# EAGLE design Solar Charger Shield v2.2 (EAGLE 6.4)
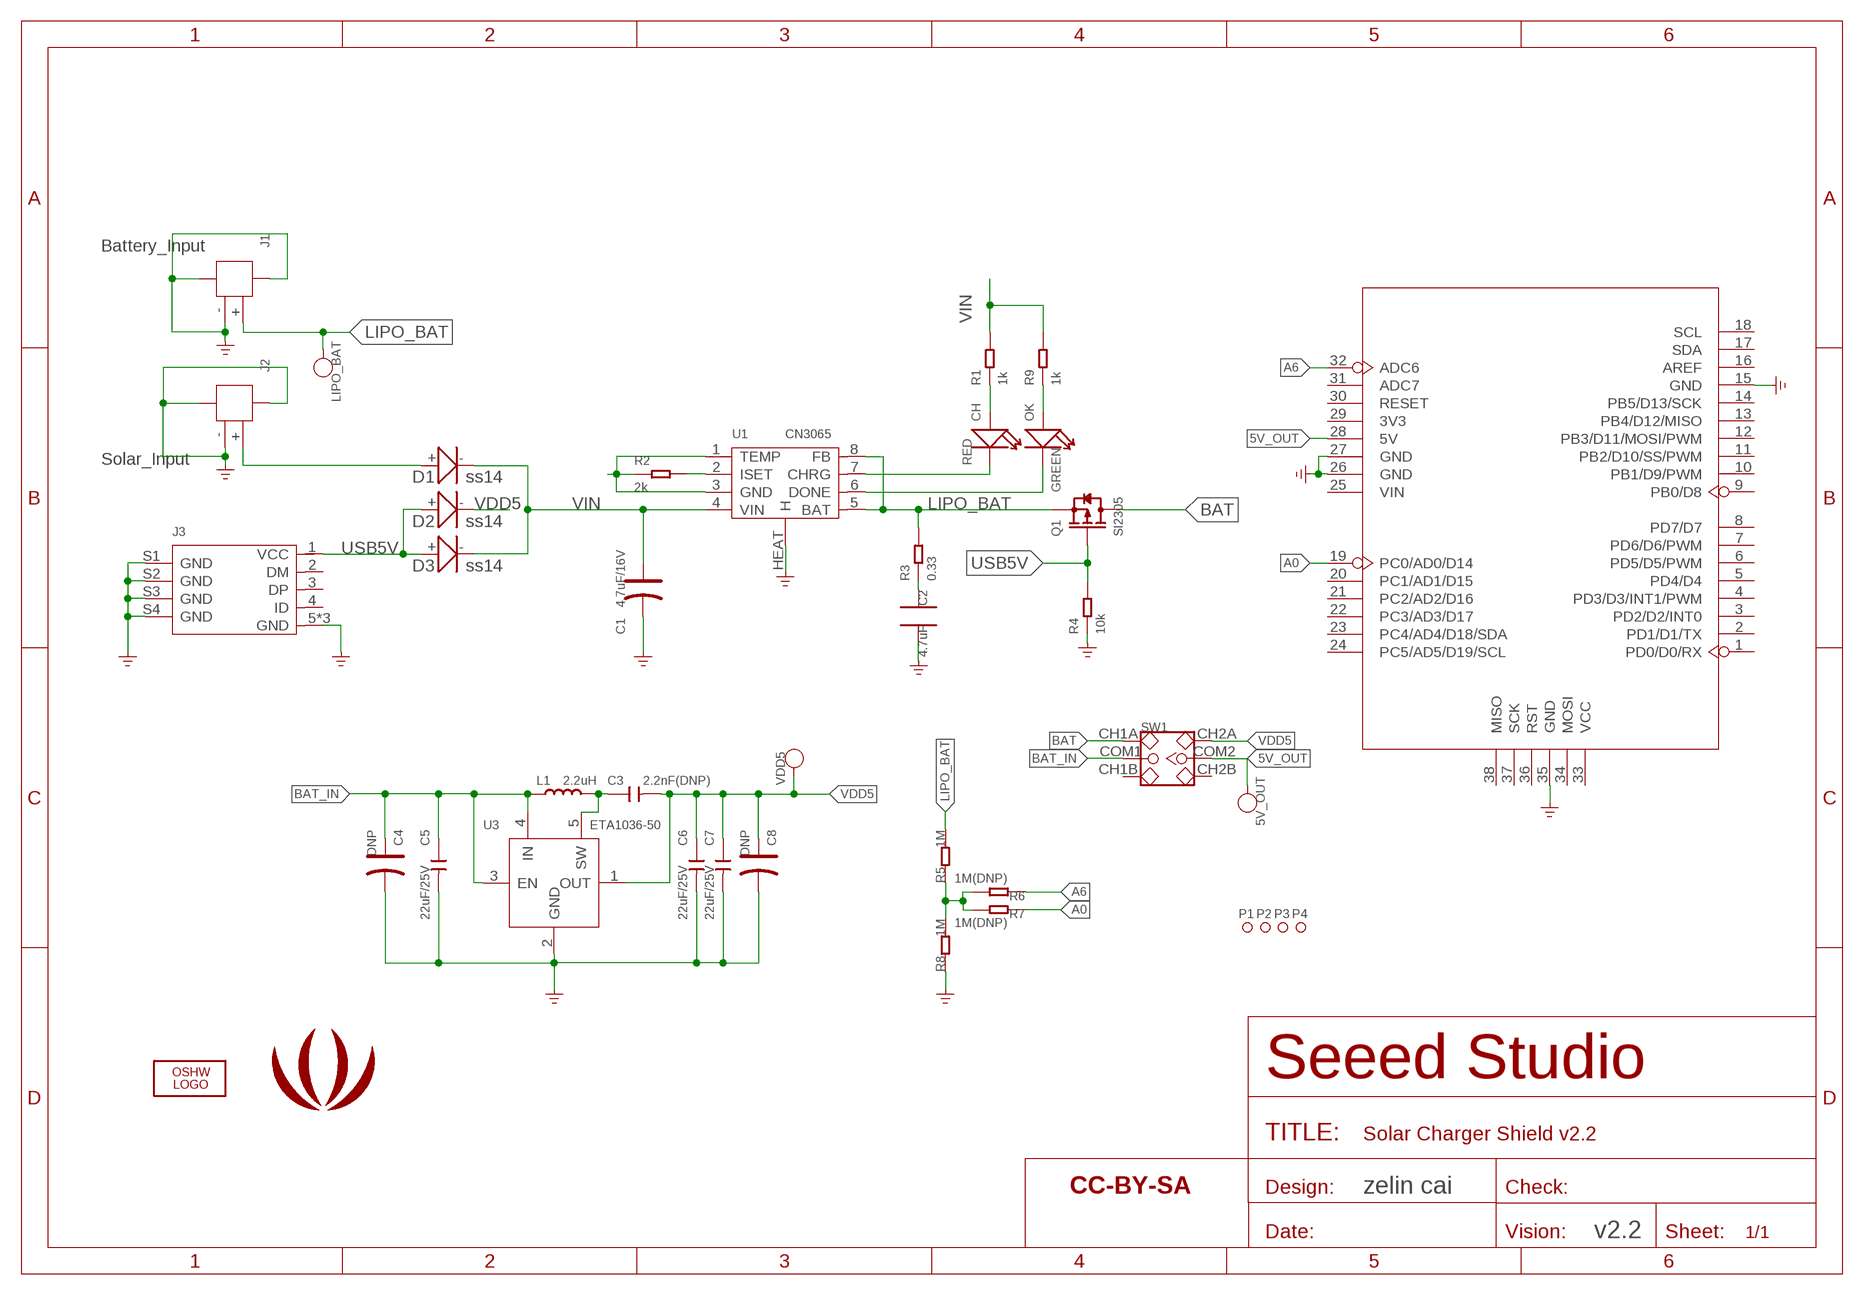
[diagram p0: schematic, sheet 1]

## Parts
5V_OUT  PAD-TEST-POINT'4545'  [TP-D45MIL]
C1  4.7uF/16V  006-CAP_AVX_A  [AVX_A]
C2  4.7uF  C0805  [0805]
C3  2.2nF(DNP)  C-0603  [C0603]
C4  DNP  CAP_AVX_A  [AVX-A]
C5  22uF/25V  CAP-0805  [C0805]
C6  22uF/25V  CAP-0805  [C0805]
C7  22uF/25V  CAP-0805  [C0805]
C8  DNP  CAP_AVX_A  [AVX-A]
CH  RED  LED'0603'  [LED-0603]
D1  ss14  010-D2010  [D2010]
D2  ss14  010-D2010  [D2010]
D3  ss14  010-D2010  [D2010]
J1  JST-2P-SMD'2.0'  [2P-SMD-2.0-90D]
J2  JST-2P-SMD'2.0'  [2P-SMD-2.0-90D]
J3  USB-MICRO-5P'5+4P'  [5+4P-SMD-0.65-B]
L1  2.2uH  INDUCTOR/FERRITE-BEAD'0630'  [L0630]
LIPO_BAT  PAD-TEST-POINT'4545'  [TP-D45MIL]
LOGO1  LOGO-OSHW-FILLX0200-NT  [OSHW_FILLX200_NOTEXT]
OK  GREEN  LED'0603'  [LED-0603]
P1  PAD-MARK'ANNULAR'  [ROUND-MARK-1.0]
P2  PAD-MARK'ANNULAR'  [ROUND-MARK-1.0]
P3  PAD-MARK'ANNULAR'  [ROUND-MARK-1.0]
P4  PAD-MARK'ANNULAR'  [ROUND-MARK-1.0]
Q1  SI2305  MOSFET-P'SI2323CDS/SI2305DS<BR>'  [SOT-23]
R1  1k  RES-0603  [R0603]
R2  2k  RES-0603  [R0603]
R3  0.33  RES-0603  [R0603]
R4  10k  RES-0603  [R0603]
R5  1M  R-0603  [0603]
R6  1M(DNP)  R-0603  [0603]
R7  1M(DNP)  R-0603  [0603]
R8  1M  R-0603  [0603]
R9  1k  RES-0603  [R0603]
SW1  SWITCH-2CH-6P'90D'  [6P-2CH-2.54-L9.0*W3.5*H3.2-90D]
U1  CN3065  PMIC-CN3065-DFN8  [DFN-8]
U2  ARDUINO-38P'WITH-SILK'  [ARDUINO-DIM-WITH-SILK]
U3  ETA1036-50  ETA1036  [SOT23-5]
U$1  LOGO-SEEEDSTUDIO-SILK  [LOGO_SILK]
U$2  SEEEDSTUDIO-OPEN-SCH-FRAME  [SEEEDSTUDIO-PCB-FRAME]
VDD5  PAD-TEST-POINT'4545'  [TP-D45MIL]

## Nets
5V_OUT: 5V_OUT.T SW1.COM2 U2.28(5V)
A0: R7.1 U2.19(PC0/AD0/D14)
A6: R6.1 U2.32(ADC6)
BAT: Q1.3(D) SW1.CH1A
BAT_IN: C4.+ C5.1 L1.1 SW1.COM1 U3.3(EN) U3.4(IN)
GND: C1.- C2.2 C4.- C5.2 C6.2 C7.2 C8.- J1.3 J1.4 J1.- J2.3 J2.4 J2.- J3.5(GND) J3.S1(GND) J3.S2(GND) J3.S3(GND) J3.S4(GND) J3.S5(GND) J3.S6(GND) R2.1 R4.1 R8.1 U1.1(TEMP) U1.3(GND) U1.HEAT(H) U2.15(GND) U2.26(GND) U2.27(GND) U2.35(GND) U3.2(GND) ; supply symbol labelled GND_POWER
LIPO_BAT: J1.+ LIPO_BAT.T Q1.2(S) R3.2 R5.2 U1.5(BAT) U1.8(FB)
N$1: R5.1 R6.2 R7.2 R8.2
N$2: C3.1 L1.2 U3.5(SW)
N$3: D1.+ J2.+
N$4: R2.2 U1.2(ISET)
N$5: CH.- U1.7(CHRG)
N$6: CH.+ R1.1
N$7: OK.- U1.6(DONE)
N$8: OK.+ R9.1
N$9: C2.1 R3.1
USB5V: D2.+ D3.+ J3.1(VCC) Q1.1(G) R4.2
VDD5: C3.2 C6.1 C7.1 C8.+ D2.- SW1.CH2A U3.1(OUT) VDD5.T
VIN: C1.+ D1.- D3.- R1.2 R9.2 U1.4(VIN)
Unconnected: J3.2(DM) J3.3(DP) J3.4(ID) SW1.CH1B SW1.CH2B U2.1(PD0/D0/RX) U2.2(PD1/D1/TX) U2.3(PD2/D2/INT0) U2.4(PD3/D3/INT1/PWM) U2.5(PD4/D4) U2.6(PD5/D5/PWM) U2.7(PD6/D6/PWM) U2.8(PD7/D7) U2.9(PB0/D8) U2.10(PB1/D9/PWM) U2.11(PB2/D10/SS/PWM) U2.12(PB3/D11/MOSI/PWM) U2.13(PB4/D12/MISO) U2.14(PB5/D13/SCK) U2.16(AREF) U2.17(SDA) U2.18(SCL) U2.20(PC1/AD1/D15) U2.21(PC2/AD2/D16) U2.22(PC3/AD3/D17) U2.23(PC4/AD4/D18/SDA) U2.24(PC5/AD5/D19/SCL) U2.25(VIN) U2.29(3V3) U2.30(RESET) U2.31(ADC7) U2.33(VCC) U2.34(MOSI) U2.36(RST) U2.37(SCK) U2.38(MISO)

## Notes on the sheet
- Battery_Input
- Solar_Input
- zelin cai
- v2.2

## Library data of the parts
5V_OUT LIPO_BAT VDD5 = Discrete-new:PAD-TEST-POINT; PARTNO: DNP
C1 = Discrete:006-CAP*: Electrolytic Capacitors,Tantalum Capacitors and Super Capacitors
C2 = CPT_SMD:C0805
C3 = Discrete:C*: Ceramic Capacitors
C4 C8 = Discrete:CAP*: Electrolytic Capacitors,Tantalum Capacitors and Super Capacitors
C5-C7 = Discrete-new:CAP: Ceramic Capacitors
CH OK = Discrete-new:LED
D1-D3 = Discrete:010-D*
J1 J2 = Connector-new:JST-2P-SMD: 2P-SMD-1.0-90D:320110054;2P-SMD-2.0-90D:320110026
J3 = Connector-new:USB-MICRO-5P: 5+4P-SMD-0.65-B:320010000;5+2P-SMD-0.65-AB:340032001
L1 = Discrete-new:INDUCTOR/FERRITE-BEAD
LOGO1 = Logo:LOGO-OSHW-FILL; PARTNO: DNP
P1-P4 = Discrete-new:PAD-MARK; PARTNO: DNP
Q1 = Discrete-new:MOSFET-P
R1-R4 R9 = Discrete-new:RES
R5-R8 = Discrete:R*
SW1 = Discrete-new:SWITCH-2CH-6P: 6P-2CH-2.54-L9.0*W3.5*H3.2+2.0MM:311010004;6P-2CH-2.54-L9.0*W3.5*H3.2-90D:311030004;6P-2CH-2.54-SMD-L7.0*W3.5*H1.5MM:311030005
U1 = IC-new:PMIC-CN3065: 310030101
U2 = moudle-new:ARDUINO-38P
U3 = IC:ETA1036
U$1 = Logo:LOGO-SEEEDSTUDIO
U$2 = moudle-new:SEEEDSTUDIO-OPEN-SCH-FRAME

## Net classes
0 default: width 0.203 mm, drill 0.305 mm, clearance 0.127 mm

## Board
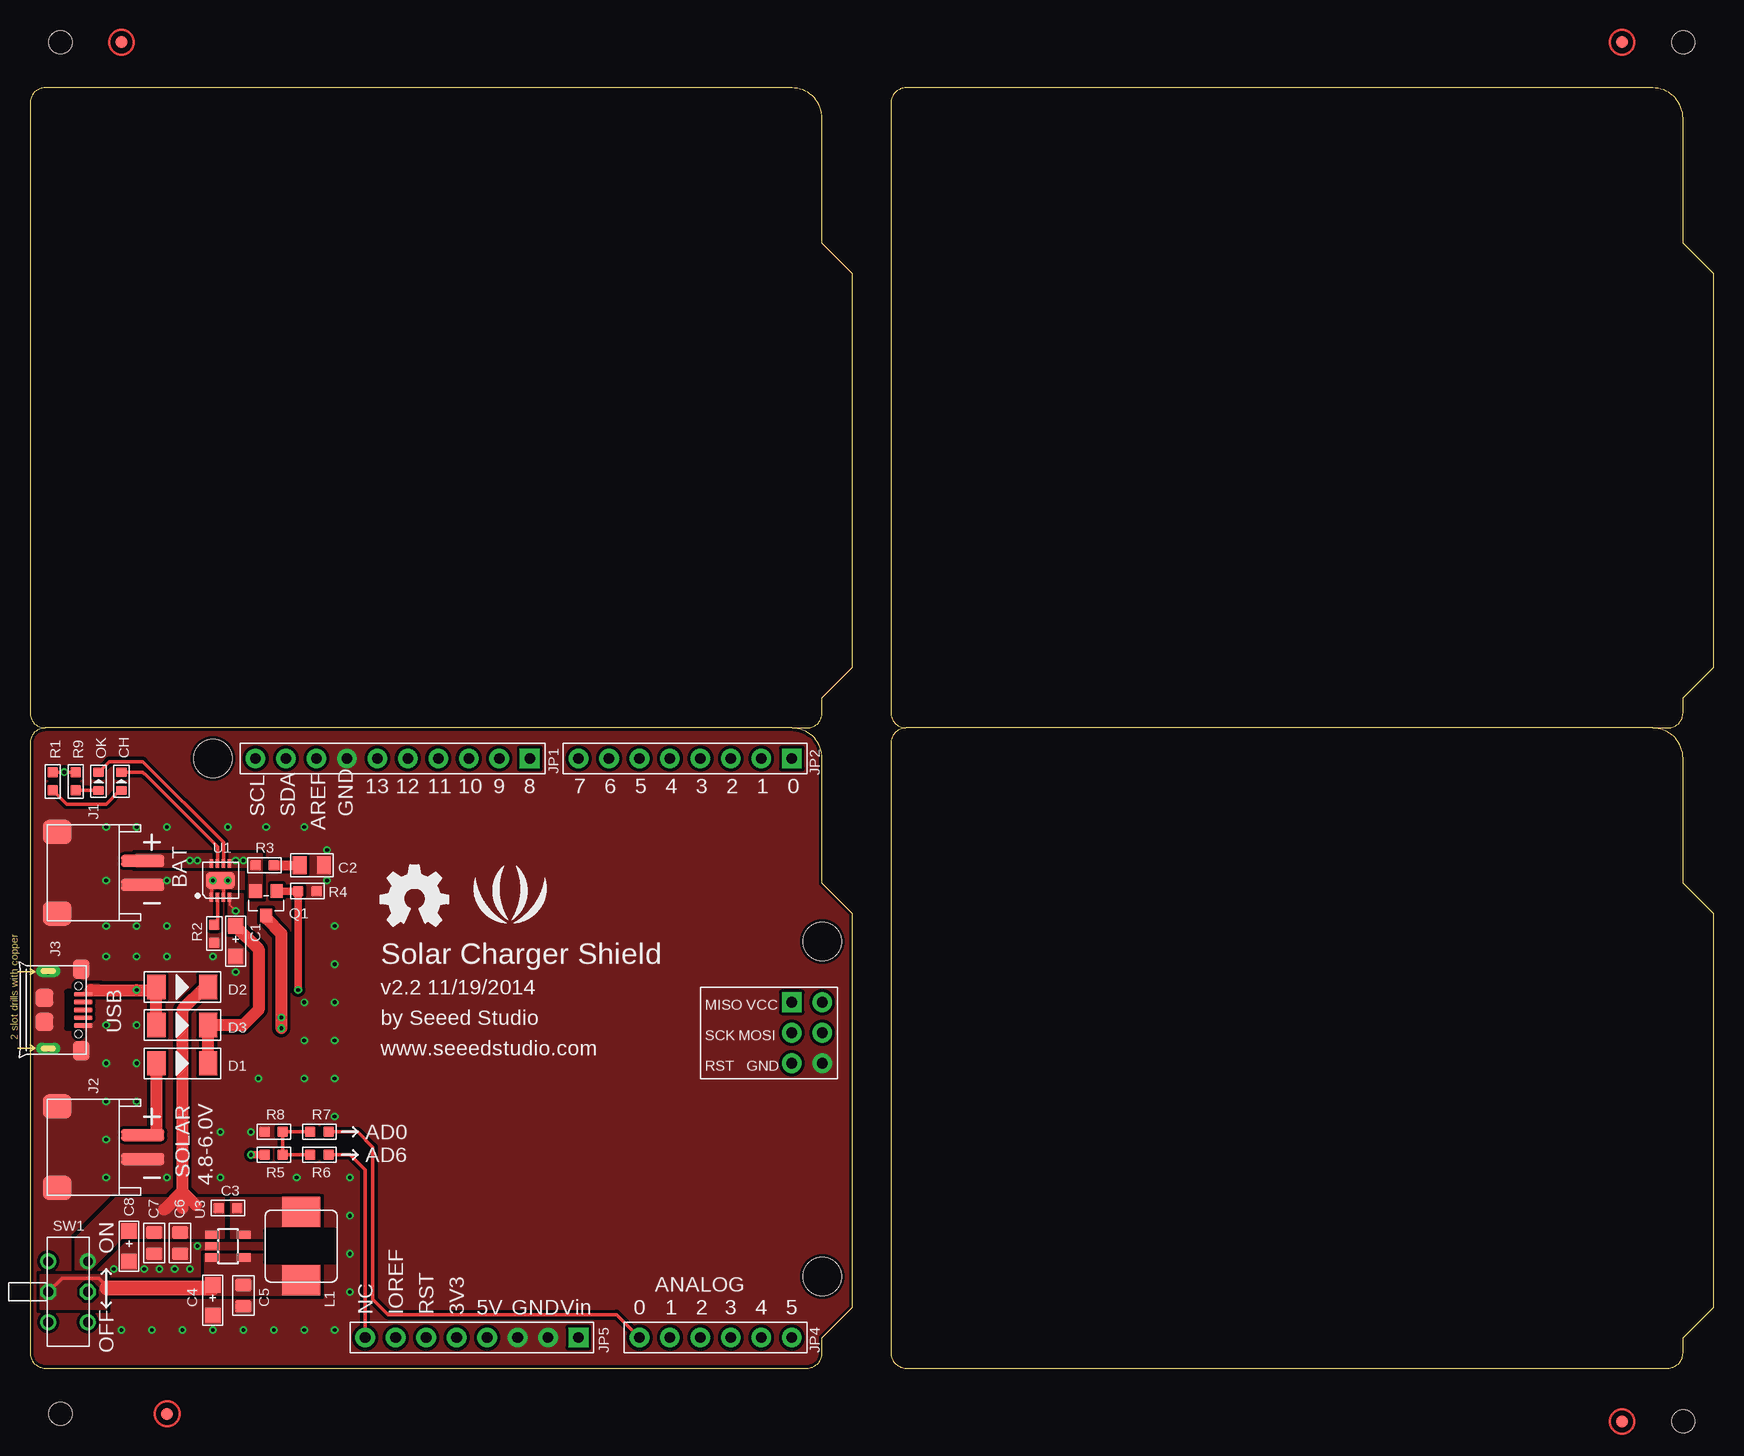
[diagram p1: board, top side]
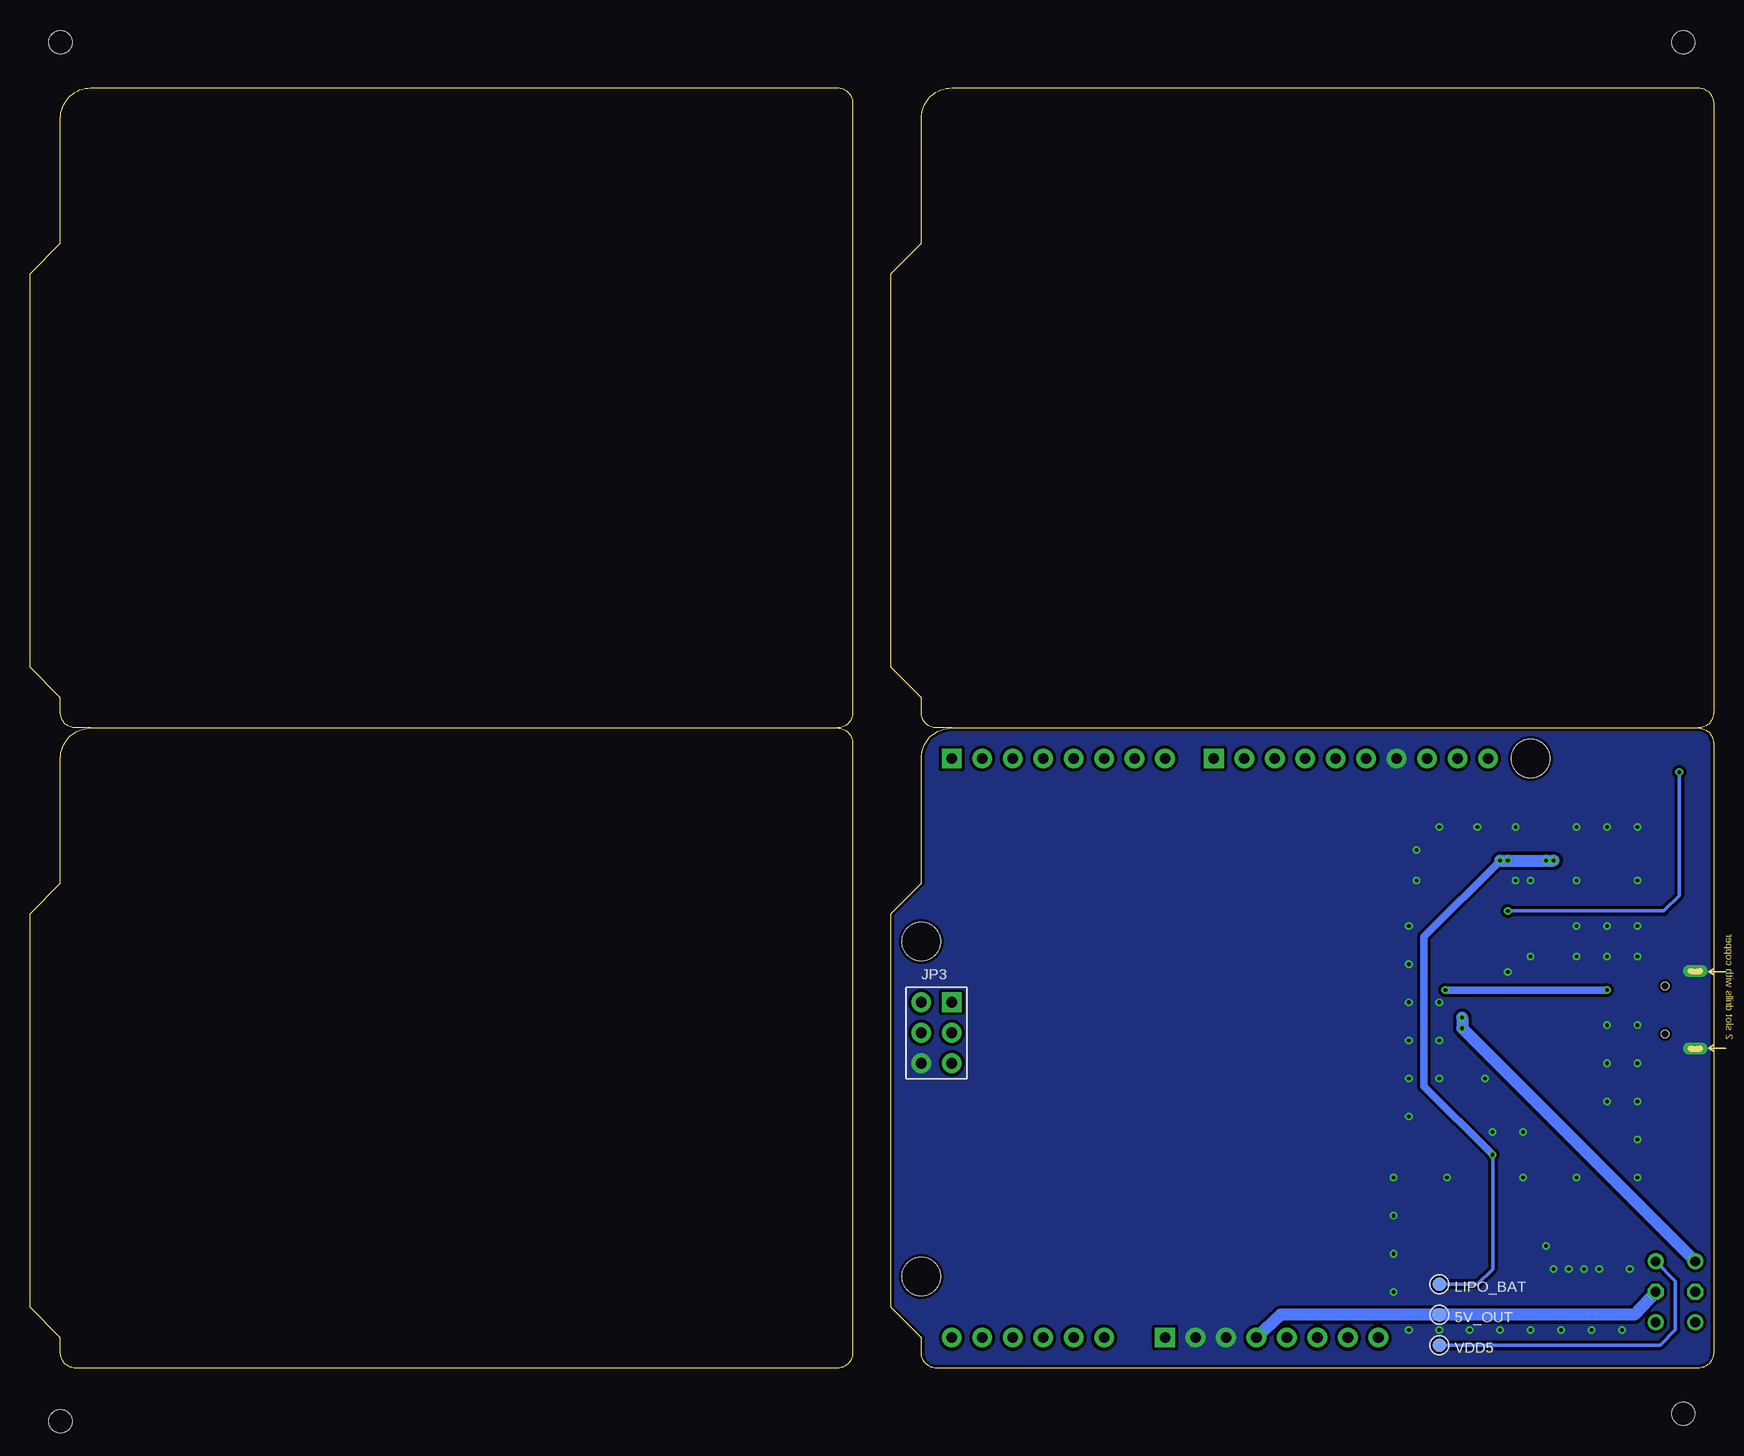
[diagram p2: board, bottom side, seen from below]

Size 140.34 x 106.68 mm. Coordinates in mm from the lower left corner, seen from the top.
Outline: 63.5,53.34 arc-90 66.04,50.8 66.04,40.39 68.58,37.85 68.58,5.08 66.04,2.54 66.04,1.27 arc-90 64.77,0 1.27,0 arc-90 0,1.27 0,52.07 arc-90 1.27,53.34
Outline: 63.5,53.34 1.27,53.34
Outline: 135.25,53.34 arc-90 137.79,50.8 137.79,40.39 140.34,37.85 140.34,5.08 137.79,2.54 137.79,1.27 arc-90 136.53,0 73.03,0 arc-90 71.75,1.27 71.75,52.07 arc-90 73.03,53.34
Outline: 135.25,53.34 73.03,53.34
Outline: 63.5,53.34 64.77,53.34 arc90 66.04,54.61 66.04,55.88 68.58,58.42 68.58,91.19 66.04,93.73 66.04,104.14 arc90 63.5,106.68 1.27,106.68 arc90 0,105.41 0,54.61 arc90 1.27,53.34
Outline: 135.25,53.34 136.53,53.34 arc90 137.79,54.61 137.79,55.88 140.34,58.42 140.34,91.19 137.79,93.73 137.79,104.14 arc90 135.25,106.68 73.03,106.68 arc90 71.75,105.41 71.75,54.61 arc90 73.03,53.34
Copper layers (1*16): Top 0.035mm / dielectric 1.5mm / Bottom 0.035mm
Design rules "SeeedStudio_DRU_no_angle_20130527": minimum track width 6mil, minimum drill 12mil, track to track 6mil, track to pad 6mil, pad to pad 6mil, via to via 6mil, smd to smd 0mil, copper to edge 10mil, drill to drill 10mil, minimum pad ring 10mil, minimum via ring 6mil, stop-mask expansion 2mil, vias tented up to drill 25mil, thermal gap 10mil
Holes 1.91 mm at 2.54,-3.81 137.79,-4.45 137.79,110.49 2.54,110.49
tRestrict: area 19.7,8.9 to 25.4,11.4

### Footprints (pad centres in the part's own frame; a part is rotated, then mirrored left to right if it is on the bottom)
TP-D45MIL = smd 1.143 x 1.143: T 0,0
AVX_A = smd 1.27 x 1.27: + -1.27,0; - 1.27,0
0805 = smd 1.143 x 1.524: 1 -1.016,0; 2 1.016,0
C0603 = smd 0.889 x 0.889: 1 -0.762,0; 2 0.762,0
AVX-A = smd 1.27 x 1.27: + -1.27,0; - 1.27,0
C0805 = smd 1.016 x 1.397: 1 -0.889,0; 2 0.889,0
LED-0603 = smd 0.762 x 0.889: + -0.762,0; - 0.762,0
D2010 = smd 1.524 x 2.032: + -2.159,0; - 2.159,0
2P-SMD-2.0-90D = smd 2 x 2.4: 3 3.4,-2.181; 4 -3.4,-2.181 | smd 1 x 3.6: + -1,4.953; - 1,4.953
5+4P-SMD-0.65-B = smd 0.381 x 1.524: 1 -1.3,-0.25; 2 -0.65,-0.25; 3 0,-0.25; 4 0.65,-0.25; 5 1.3,-0.25 | smd 1.6 x 1.397: S1 -3.4,-0.427; S6 3.4,-0.427 | drill 0.508 pad 1.016 long: S2 -3.226,-3.175; S5 3.226,-3.175 | smd 1.5 x 1.5: S3 -1,-3.5; S4 1,-3.5 | hole 0.635: -2,-0.65; 2,-0.65
L0630 = smd 2.5 x 3.2: 1 -2.85,0; 2 2.85,0
ROUND-MARK-1.0 = smd 1.016 x 1.016: P$1 0,0
SOT-23 = smd 1.016 x 1.143: 1 -0.889,-1.016; 2 0.889,-1.016; 3 0,1.016
R0603 = smd 0.889 x 0.889: 1 -0.762,0; 2 0.762,0
0603 = smd 0.889 x 0.889: 1 -0.762,0; 2 0.762,0
6P-2CH-2.54-L9.0*W3.5*H3.2-90D = drill 0.813 pad 1.27: CH1A -2.54,-1.65; CH1B 2.54,-1.65; CH2A -2.54,1.65; CH2B 2.54,1.65 | drill 0.813 pad 1.27 octagon: COM1 0,-1.65; COM2 0,1.65
DFN-8 = smd 0.3 x 0.727: 1 -0.75,-1.413; 2 -0.25,-1.413; 3 0.25,-1.413; 4 0.75,-1.413; 5 0.75,1.413; 6 0.25,1.413; 7 -0.25,1.413; 8 -0.75,1.413 | smd 2.413 x 1.397: HEAT 0,0
ARDUINO-DIM-WITH-SILK = drill 0.889 pad 1.651 square: 1 63.5,50.8; 9 41.656,50.8; 25 45.72,2.54; 38 63.5,30.48 | drill 0.889 pad 1.651: 2 60.96,50.8; 3 58.42,50.8; 4 55.88,50.8; 5 53.34,50.8; 6 50.8,50.8; 7 48.26,50.8; 8 45.72,50.8; 10 39.116,50.8; 11 36.576,50.8; 12 34.036,50.8; 13 31.496,50.8; 14 28.956,50.8; 15 26.416,50.8; 16 23.876,50.8; 17 21.336,50.8; 18 18.796,50.8; 19 50.8,2.54; 20 53.34,2.54; 21 55.88,2.54; 22 58.42,2.54; 23 60.96,2.54; 24 63.5,2.54; 26 43.18,2.54; 27 40.64,2.54; 28 38.1,2.54; 29 35.56,2.54; 30 33.02,2.54; 31 30.48,2.54; 32 27.94,2.54; 33 66.04,30.48; 34 66.04,27.94; 35 66.04,25.4; 36 63.5,25.4; 37 63.5,27.94 | hole 3.2: 15.24,50.8; 66.04,35.56; 66.04,7.62
SOT23-5 = smd 0.69 x 1.2: 1 -0.95,-1.3; 2 0,-1.3; 3 0.95,-1.3; 4 0.95,1.3; 5 -0.95,1.3

### Placement (x,y rotation side)
5V_OUT  22.86,4.45 0 bottom
C1  17.14,35.56 270 top
C2  23.5,41.91 0 top
C3  16.51,13.34 180 top
C4  15.24,5.65 270 top
C5  17.78,6.03 270 top
C6  12.51,10.41 270 top
C7  10.35,10.41 270 top
C8  8.26,10.16 270 top
CH  7.62,48.9 90 top
D1  12.7,25.4 0 top
D2  12.7,31.75 0 top
D3  12.7,28.57 0 top
J1  4.45,41.27 270 top
J2  4.45,18.41 270 top
J3  4.7,29.84 270 top
L1  22.61,10.16 90 top
LIPO_BAT  22.86,6.99 0 bottom
LOGO1  29.21,36.83 0 top
OK  5.71,48.9 90 top
P1  7.62,110.49 0 top  (outside the outline)
P2  11.43,-3.81 0 top  (outside the outline)
P3  132.72,110.49 0 top  (outside the outline)
P4  132.72,-4.45 0 top  (outside the outline)
Q1  19.68,38.73 180 top
R1  1.91,48.9 90 top
R2  15.37,36.2 90 top
R3  19.56,41.91 180 top
R4  23.11,39.75 180 top
R5  20.32,17.78 180 top
R6  24.13,17.78 180 top
R7  24.13,19.68 180 top
R8  20.32,19.68 0 top
R9  3.81,48.9 90 top
SW1  3.17,6.35 270 top
U1  15.88,40.64 0 top
U2  0,0 0 top
U3  16.51,10.16 270 top
U$1  40.01,38.73 0 top
U$2  -6.1,-16 0 top  (outside the outline)
VDD5  22.86,1.91 0 bottom

### Tracks (layer width: path | path; a pad name or v marks a point on that pad's centre or on a via)
5V_OUT
  Bottom 1.016: SW1.COM2 6.6,4.45 5V_OUT.T 36.07,4.45 U2.28
A0
  Top 0.305: R7.1 27.3,19.68 28.57,18.41 28.57,5.71 29.84,4.45 48.9,4.45 U2.19
A6
  Top 0.305: U2.32 27.94,16.51 26.67,17.78 R6.1
BAT  (via drill 0.3 pad 0.64)
  Top 1.016: Q1.3 19.68,37.47 20.95,36.2 v20.95,29.21 v20.95,28.32
  Bottom 1.016: SW1.CH1A v20.95,28.32 v20.95,29.21
BAT_IN
  Top 0.305: 6.41,6.67 6.41,6.79 5.71,7.49 2.67,7.49 SW1.COM1
  Top 1.016: C4.+ 15.24,6.73 15.18,6.67 15.18,6.54 15.24,6.6 15.24,6.67
  Top 1.27: 15.24,6.73 15.24,6.67 6.41,6.67
  pour Top (isolate 0.254, no thermals): 0.89,4.95 0.89,7.75 6.35,7.75 6.35,4.95
  pour Top (isolate 0.254, no thermals): 14.61,9.46 24.13,9.46 24.13,6.1 14.61,6.1
GND  (via drill 0.3 pad 0.64)
  Top 0.305: U1.1 15.12,40.52 v15.24,40.64 | U1.3 16.12,40.51 16.26,40.64 v16.51,40.64
  other vias: 9.53,8.26 10.79,8.26 12.06,8.26 6.99,8.26 13.34,8.26 15.24,3.17 17.78,3.17 12.7,3.17 18.41,19.68 13.97,10.16 26.67,12.7 26.67,9.53 26.67,6.35 15.88,15.88 22.23,15.88 26.67,15.88 11.43,15.88 15.88,19.68 24.77,40.64 24.77,43.18 11.43,40.64 15.24,34.29 17.14,33.02 8.89,28.57 8.89,25.4 8.89,22.23 6.35,22.23 6.35,19.05 6.35,15.88 6.35,25.4 6.35,28.57 6.35,40.64 6.35,45.09 11.43,45.09 8.89,45.09 11.43,34.29 6.35,34.29 8.89,34.29 11.43,36.83 8.89,36.83 6.35,36.83 22.86,30.48 22.86,27.3 22.86,24.13 19.05,24.13 10.16,3.17 7.62,3.17 20.32,3.17 22.86,3.17 25.4,3.17 16.51,45.09 19.68,45.09 22.86,45.09 25.4,24.13 25.4,27.3 25.4,30.48 25.4,33.66 25.4,36.83 25.4,20.95
  pour Top (isolate 0.254, rank 6, no thermals): 0,0 68.58,0 68.58,53.34 0,53.34
  pour Bottom (isolate 0.254, rank 6, no thermals): 0,0 68.58,0 68.58,53.34 0,53.34
LIPO_BAT  (via drill 0.3 pad 0.64)
  Top 0.61: R5.2 v18.41,17.78
  Bottom 0.305: v18.41,17.78 18.41,8.26 19.68,6.99 LIPO_BAT.T
  Bottom 0.61: v18.41,17.78 24.13,23.5 24.13,35.94 v17.78,42.29
  Bottom 1.016: v17.78,42.29 v17.14,42.29 v13.97,42.29 v13.34,42.29
  pour Top (isolate 0.254, no thermals): 16.51,42.8 19.3,42.8 19.3,39.24 18.29,39.24 18.29,41.78 16.51,41.78
  pour Top (isolate 0.254, no thermals): 15.11,42.8 8.89,42.8 8.89,41.78 15.11,41.78
N$1
  Top 0.305: R6.2 R5.1 R8.2 | R7.2 R8.2 | 20.95,19.68 R8.2
N$2
  pour Top (isolate 0.254, no thermals): 16.76,14.16 24.13,14.16 24.13,10.86 16.76,10.86
N$3
  Top 1.016: D1.+ 10.54,19.43 10.53,19.41 J2.+
N$4
  Top 0.305: U1.2 15.62,37.22 R2.2
N$5
  Top 0.305: U1.7 15.62,43.43 9.59,49.47 9.53,49.53 9.4,49.66 CH.-
N$6
  Top 0.305: CH.+ 7.49,48.13 6.35,46.99 3.05,46.99 R1.1 1.78,48.26
N$7
  Top 0.305: U1.6 16.12,43.82 9.4,50.55 6.6,50.55 OK.-
N$8
  Top 0.305: R9.1 OK.+
N$9
  Top 0.813: R3.1 C2.1
USB5V  (via drill 0.3 pad 0.64)
  Top 0.203: J3.1 4.73,31.14 5.08,31.5
  Top 0.61: Q1.1 R4.2 v22.35,31.5 | 9.14,31.62 9.02,31.62 v8.89,31.5
  Top 1.016: D3.+ 10.54,31.62 | 10.54,31.62 D2.+ | 5.08,31.5 v8.89,31.5 10.41,31.5 10.54,31.62
  Bottom 0.61: v22.35,31.5 v8.89,31.5
  pour Top (isolate 0.254, no thermals): 3.81,31.05 3.81,31.94 5.71,31.94 5.71,31.05
VDD5
  Top 1.016: D2.- 14.61,31.75 12.7,29.84 12.7,14.73 | 12.7,14.73 12.7,13.34 | 12.7,14.73 13.84,13.59 | 12.7,14.73 11.18,13.21
  Bottom 0.305: VDD5.T 4.45,1.91 3.17,3.17 3.17,7.24 SW1.CH2A
  pour Top (no thermals): 3.81,8.26 5.08,8.26 7.68,10.86 16.13,10.86 16.13,14.16 7.16,14.16 3.81,10.82
VIN  (via drill 0.3 pad 0.64)
  Top 0.203: U1.4 16.62,38.62 v17.14,38.1
  Top 0.305: R1.2 v2.86,49.66 R9.2
  Top 1.016: D1.- 14.86,28.45 | 14.86,28.45 D3.- | C1.+ 19.05,34.92 19.05,29.84 17.78,28.57 14.99,28.57 14.86,28.45
  Bottom 0.305: v17.14,38.1 4.13,38.1 2.86,39.37 v2.86,49.66
  pour Top (no thermals): 16.57,39.5 16.57,36.32 17.72,36.32 17.72,39.5

### Text on the board
tPlace: BAT | Solar Charger Shield | v2.2 11/19/2014 | by Seeed Studio | USB | www.seeedstudio.com | AD0 | AD6 | SOLAR | 4.8-6.0V | ON | OFF